# EAGLE board Inverter New 2 (EAGLE 9.1.2), part 1 of 2
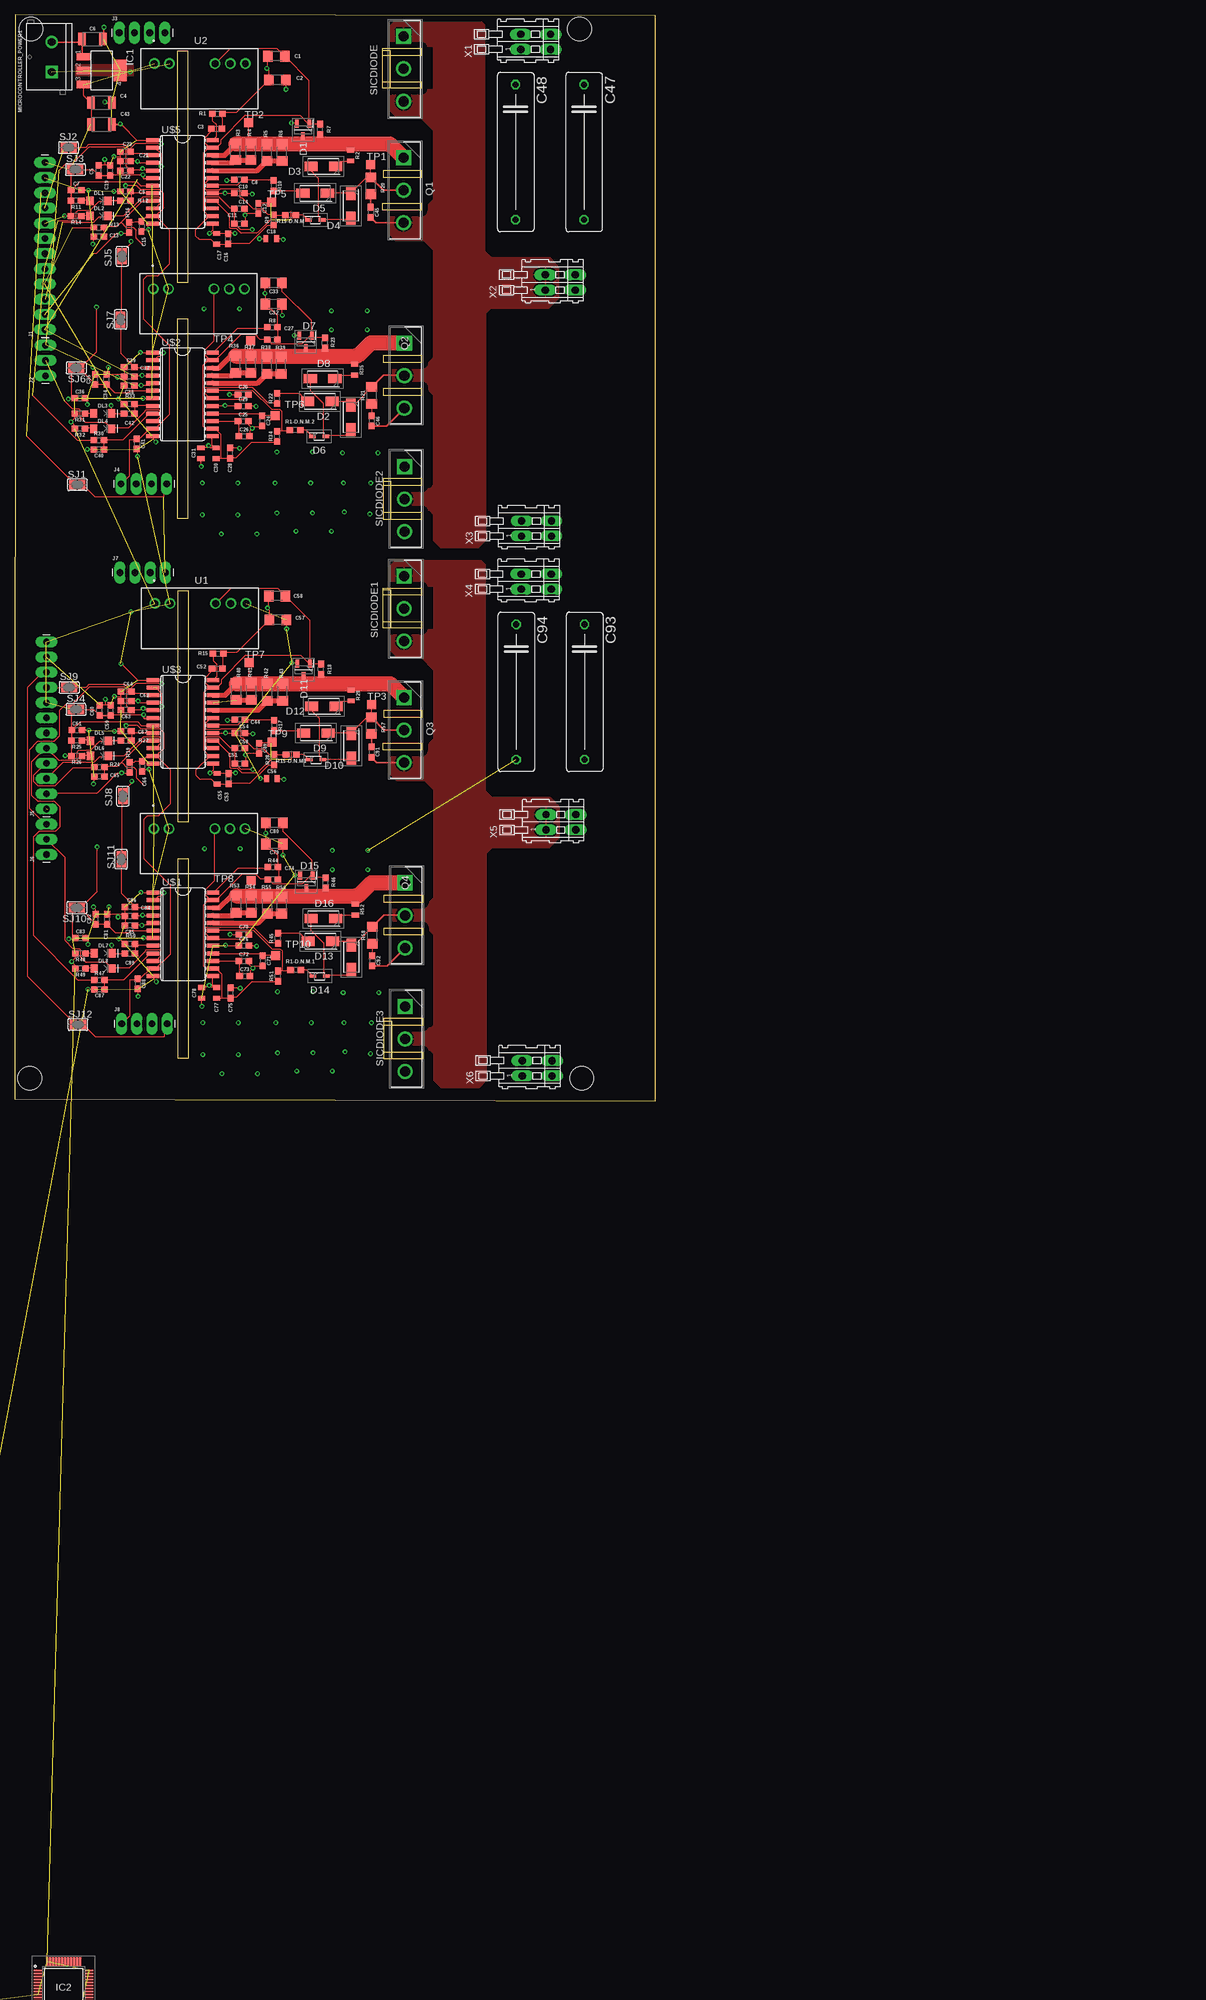
[diagram p5: board, top side]
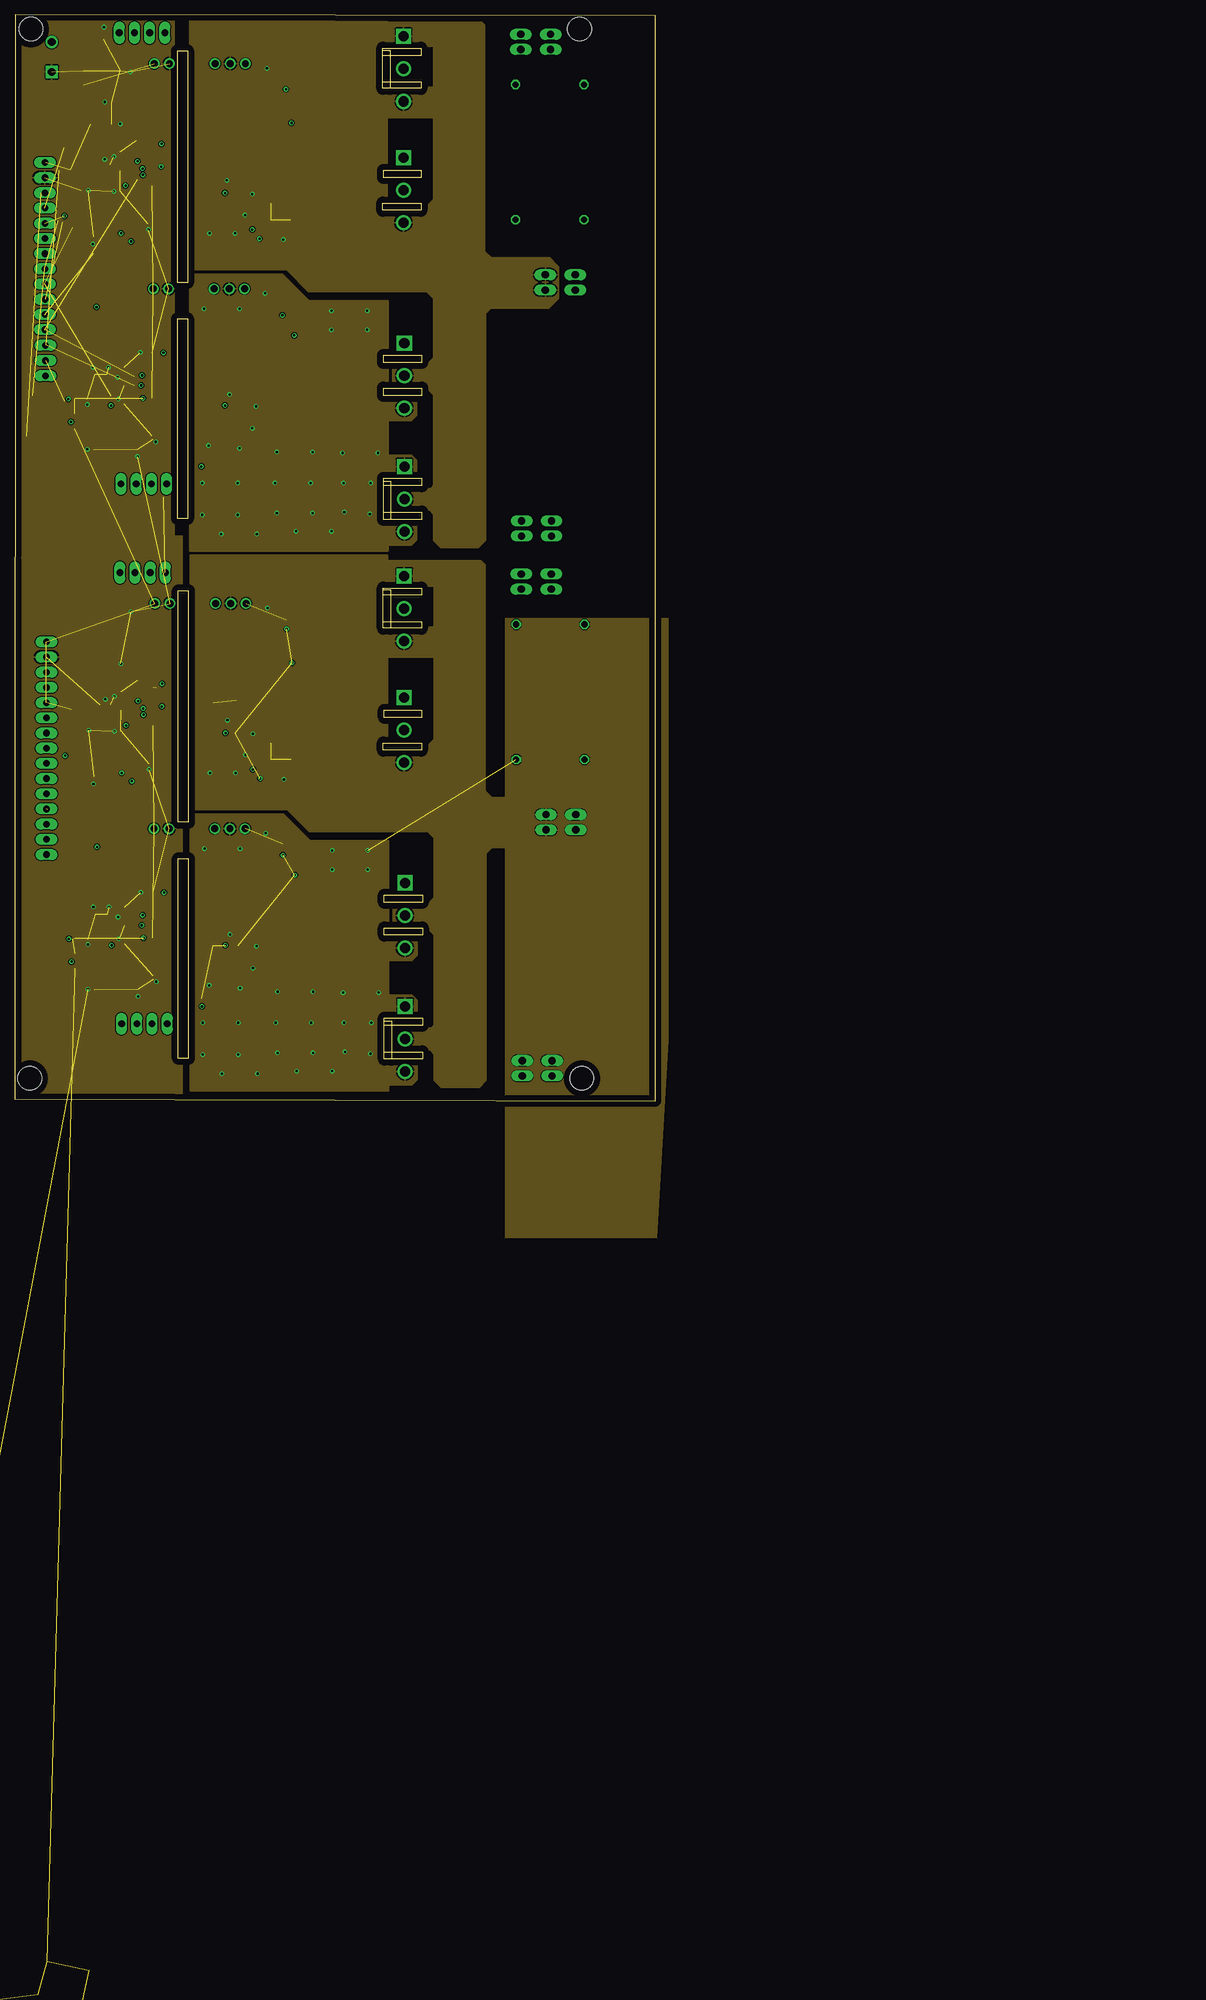
[diagram p6: board, inner layer Route2]
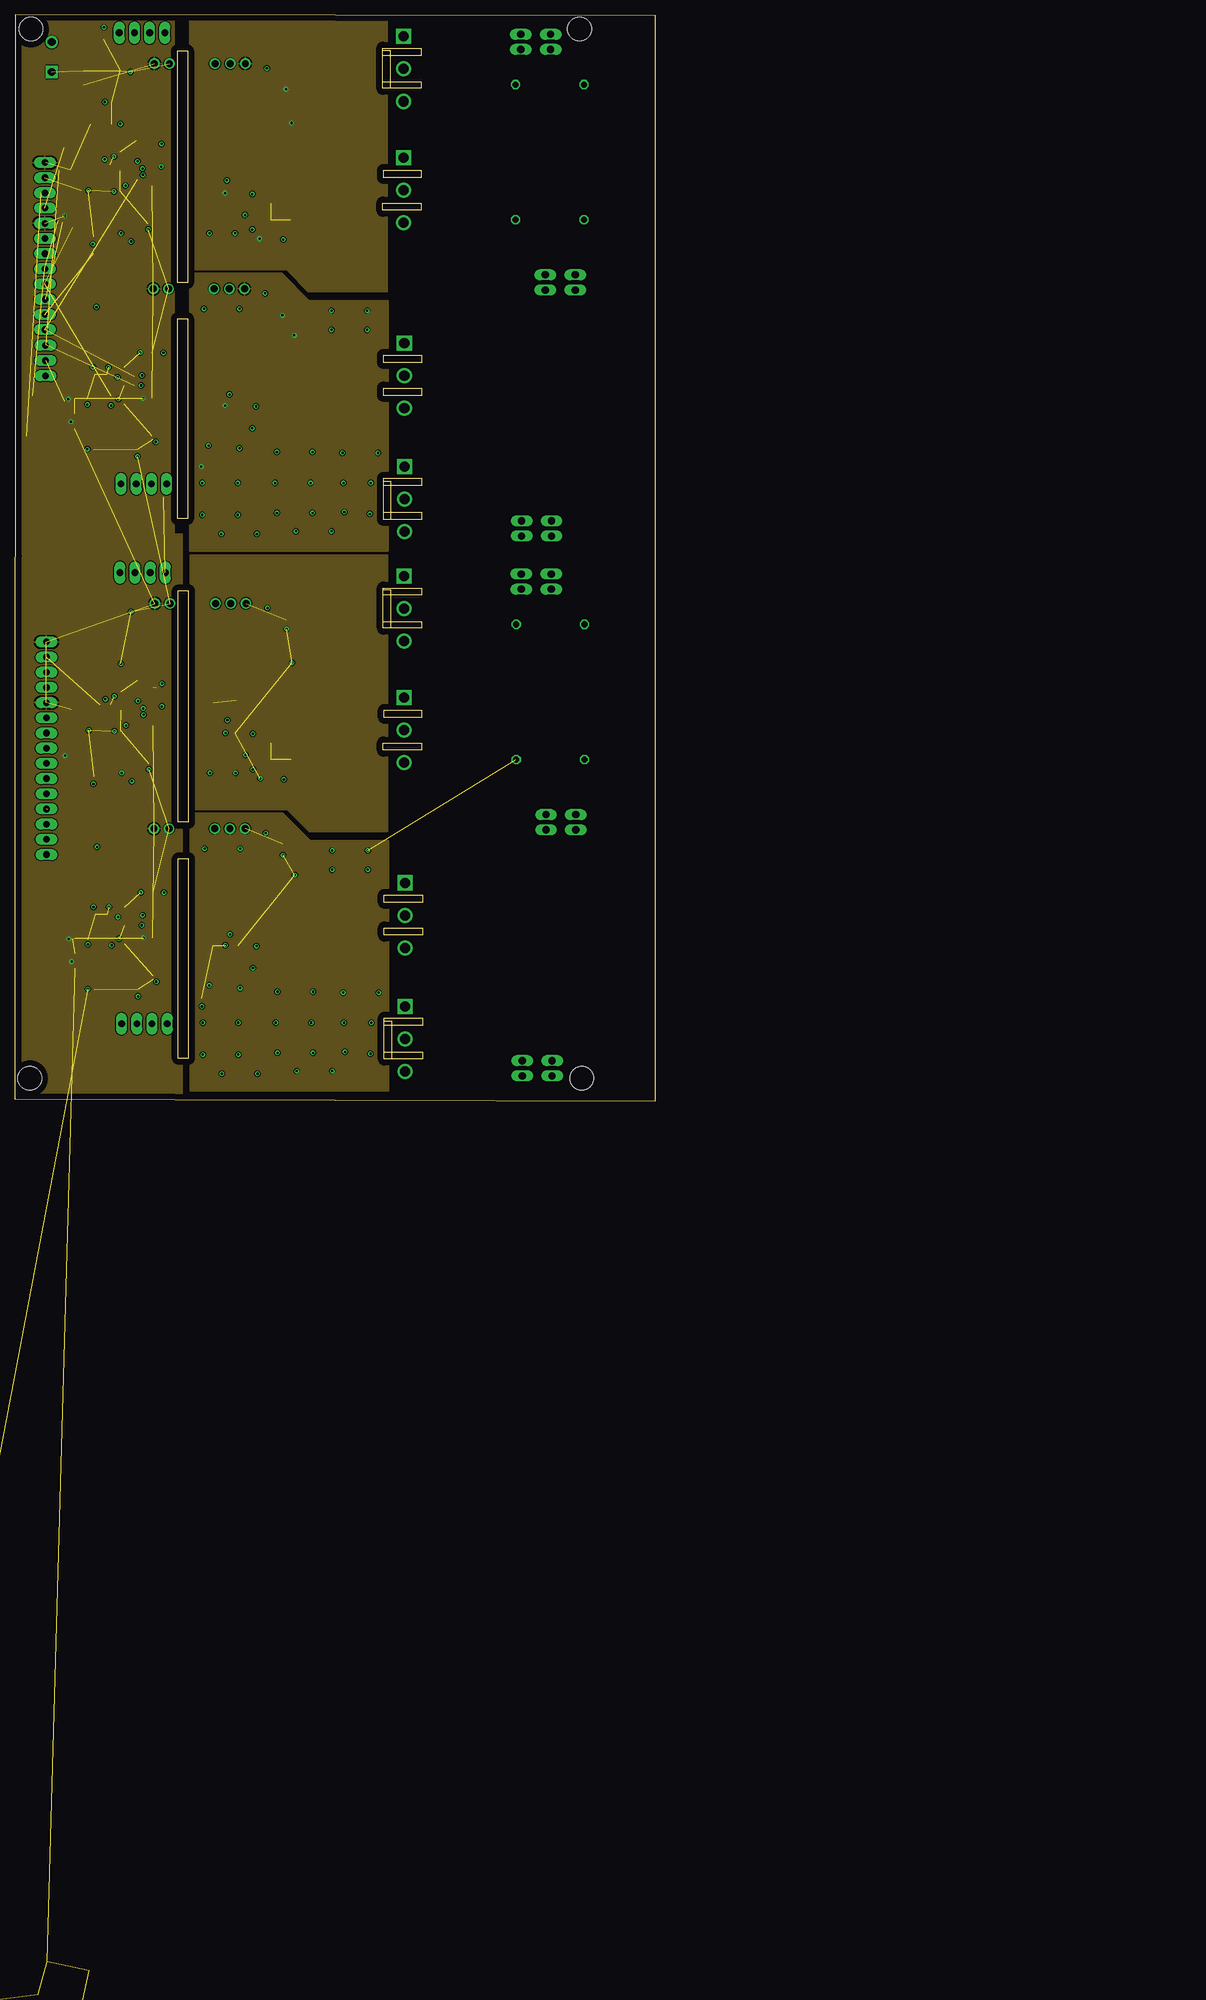
[diagram p7: board, inner layer Route15]
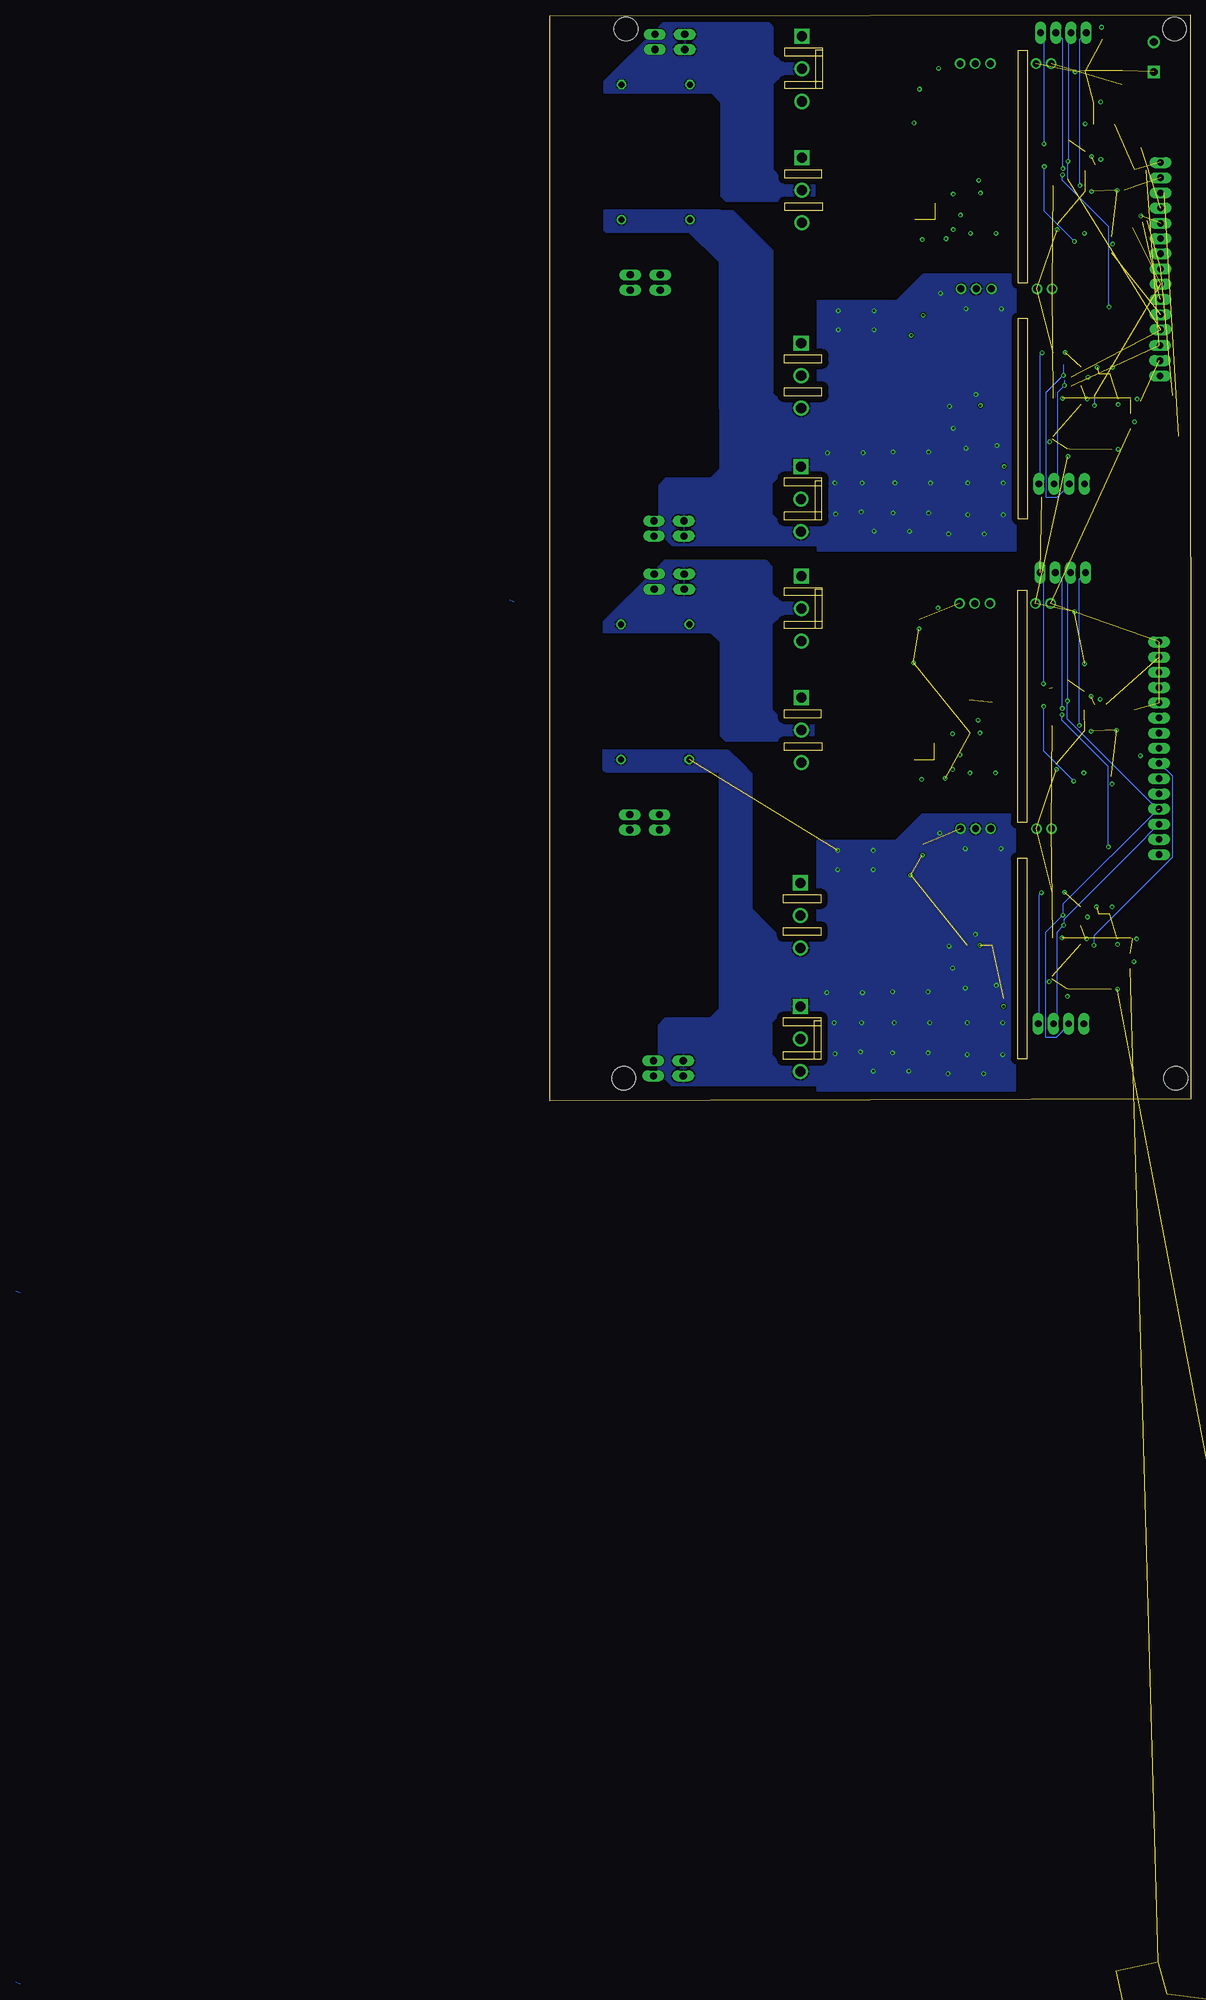
[diagram p8: board, bottom side, seen from below]

Size 107.17 x 181.59 mm. Coordinates in mm from the lower left corner, seen from the top.
Outline: 0,0.3 107.12,0 107.17,181.44 0.05,181.59 0,0.3
Copper layers (1*2+15*16): Top 0.035mm / dielectric 1.15mm / Route2 0.035mm / dielectric 0.15mm / Route15 0.035mm / dielectric 0.2mm / Bottom 0.035mm
Design rules "default *": minimum track width 6mil, minimum drill 0.35mm, track to track 6mil, track to pad 6mil, pad to pad 6mil, via to via 6mil, smd to smd 6mil, copper to edge 40mil, drill to drill 6mil, minimum pad ring 10mil, minimum via ring 8mil, stop-mask expansion 4mil, vias tented up to drill 0mil, thermal gap 10mil
Net classes: 0 default: width 0.1 mm, drill 0.2 mm, clearance 0.003 mm
Holes 4 mm at 94.41,179.23 2.67,179.23 94.81,3.77 2.46,3.77

## Footprints (pad centres in the part's own frame; a part is rotated, then mirrored left to right if it is on the bottom)
SPARKFUN-CAPACITORS_1206 = smd 1.6 x 1.8: 1 -1.4,0; 2 1.4,0
SPARKFUN-CAPACITORS_0603 = smd 1.1 x 1: 1 -0.85,0; 2 0.85,0
SPARKFUN-CAPACITORS_1210 = smd 1.27 x 2.06: 1 -1.755,0; 2 1.755,0
SPARKFUN-CAPACITORS_0805 = smd 0.8 x 1.2: 1 -0.9,0; 2 0.9,0
C225-062X268 = drill 1.016 octagon: 1 -11.303,0; 2 11.303,0
BAT54SFILM_SOT105P242X150-3N = smd 1.35 x 0.6: 1 -1.05,1.05; 2 -1.05,-1.05; 3 1.05,0
STTH112A_DIOM5126X265N = smd 2.2 x 1.55: 1 -2.05,0; 2 2.05,0
STPS2H100A_DIOM5126X265N = smd 2.2 x 1.55: 1 -2.05,0; 2 2.05,0
BAT20JFILM_SOD2512X113N = smd 1.11 x 0.55: 1 -1.14,0; 2 1.14,0
SPARKFUN-LED_LED-1206 = smd 1.2 x 1.4: A -1.5,0; C 1.5,0
NATIONAL-SEMICONDUCTOR_SOT223 = smd 1.219 x 2.235: 1 -2.311,-3.099; 2 0,-3.099; 3 2.311,-3.099 | smd 3.6 x 2.2: 4 0,3.099
QFP50P900X900X160-48N = smd 1.475 x 0.3: 1 -4.238,2.75; 2 -4.238,2.25; 3 -4.238,1.75; 4 -4.238,1.25; 5 -4.238,0.75; 6 -4.238,0.25; 7 -4.238,-0.25; 8 -4.238,-0.75; 9 -4.238,-1.25; 10 -4.238,-1.75; 11 -4.238,-2.25; 12 -4.238,-2.75; 25 4.238,-2.75; 26 4.238,-2.25; 27 4.238,-1.75; 28 4.238,-1.25; 29 4.238,-0.75; 30 4.238,-0.25; 31 4.238,0.25; 32 4.238,0.75; 33 4.238,1.25; 34 4.238,1.75; 35 4.238,2.25; 36 4.238,2.75 | smd 0.3 x 1.475: 13 -2.75,-4.238; 14 -2.25,-4.238; 15 -1.75,-4.238; 16 -1.25,-4.238; 17 -0.75,-4.238; 18 -0.25,-4.238; 19 0.25,-4.238; 20 0.75,-4.238; 21 1.25,-4.238; 22 1.75,-4.238; 23 2.25,-4.238; 24 2.75,-4.238; 37 2.75,4.238; 38 2.25,4.238; 39 1.75,4.238; 40 1.25,4.238; 41 0.75,4.238; 42 0.25,4.238; 43 -0.25,4.238; 44 -0.75,4.238; 45 -1.25,4.238; 46 -1.75,4.238; 47 -2.25,4.238; 48 -2.75,4.238
RN42IRM630 = smd 2 x 0.8: 1 -6,5.75; 2 -6,4.55; 3 -6,3.35; 4 -6,2.15; 5 -6,0.95; 6 -6,-0.25; 7 -6,-1.45; 8 -6,-2.65; 9 -6,-3.85; 10 -6,-5.05; 11 -6,-6.25; 12 -6,-7.45; 13 6.8,-7.45; 14 6.8,-6.25; 15 6.8,-5.05; 16 6.8,-3.85; 17 6.8,-2.65; 18 6.8,-1.45; 19 6.8,-0.25; 20 6.8,0.95; 21 6.8,2.15; 22 6.8,3.35; 23 6.8,4.55; 24 6.8,5.75 | smd 0.8 x 2: 28 3.8,-10.25; 29 -2.4,-10.25; 30 4.8,-10.25; 31 2.5,-10.25; 32 1.3,-10.25; 33 0.1,-10.25; 34 -1.1,-10.25; 35 -3.4,-10.25 | smd 1.8 x 1: 36 -4.9,9.45; 37 -4.9,-9.55; 38 6.3,-9.55; 39 6.3,9.45
SPARKFUN-CONNECTORS_1X12_LONGPADS = drill 1.118 pad 1.88 long: 1 0,0; 2 2.54,0; 3 5.08,0; 4 7.62,0; 5 10.16,0; 6 12.7,0; 7 15.24,0; 8 17.78,0; 9 20.32,0; 10 22.86,0; 11 25.4,0; 12 27.94,0
SPARKFUN-CONNECTORS_1X03_LONGPADS = drill 1.118 pad 1.88 long: 1 0,0; 2 2.54,0; 3 5.08,0
SPARKFUN-CONNECTORS_1X04_LONGPADS = drill 1.118 pad 1.88 long: 1 0,0; 2 2.54,0; 3 5.08,0; 4 7.62,0
SPARKFUN-CONNECTORS_SCREWTERMINAL-5MM-2 = drill 1.3 pad 2.032 square: 1 0,0 | drill 1.3 pad 2.032: 2 5,0
C2M0280120D_TO544P521X1594X2550-3P = drill 1.69 pad 2.535 square: 1 0,0 | drill 1.69 pad 2.535: 2 5.44,0; 3 10.88,0
SPARKFUN-RESISTORS_0603 = smd 1.1 x 1: 1 -0.85,0; 2 0.85,0
SPARKFUN-RESISTORS_0805 = smd 0.8 x 1.2: 1 -0.9,0; 2 0.9,0
SPARKFUN-RESISTORS_1206 = smd 1.6 x 1.8: 1 -1.4,0; 2 1.4,0
JUMPER_SJ = smd 1.168 x 1.6: 1 -0.762,0; 2 0.762,0
TP15SQ = smd 1.5 x 1.5: TP 0,0
SAMACSYS_LIB_MGJ2D_7-PIN-SIP = drill 1.15 pad 1.75: 1 2.27,-2.53; 2 4.81,-2.53; 5 12.43,-2.53; 6 14.97,-2.53; 7 17.51,-2.53
SO24E-IC_SO24W = smd 0.66 x 2.032: 1 -4.445,-3.759; 2 -3.175,-3.759; 3 -1.905,-3.759; 4 -0.635,-3.759; 5 0.635,-3.759; 6 1.905,-3.759; 7 3.175,-3.759; 8 4.445,-3.759; 9 5.715,-3.759; 10 6.985,-3.759; 11 8.255,-3.759; 12 9.525,-3.759; 13 9.525,6.299; 14 8.255,6.299; 15 6.985,6.299; 16 5.715,6.299; 17 4.445,6.299; 18 3.175,6.299; 19 1.905,6.299; 20 0.635,6.299; 21 -0.635,6.299; 22 -1.905,6.299; 23 -3.175,6.299; 24 -4.445,6.299
234-502 = drill 1.2 long: A1 -1.27,2.5; A2 1.27,2.5; B1 -1.27,-2.5; B2 1.27,-2.5

## Placement (x,y rotation side)
C1  2.2uF  [SPARKFUN-CAPACITORS_1206]  43.74,174.69 180 top
C2  2.2uF  [SPARKFUN-CAPACITORS_1206]  43.89,170.72 180 top
C3  0.1uF  [SPARKFUN-CAPACITORS_0603]  33.73,162.57 0 top
C4  10uF  [SPARKFUN-CAPACITORS_1210]  14.45,166.91 0 top
C5  0.1uF  [SPARKFUN-CAPACITORS_0603]  14.05,155.58 90 top
C6  10uF  [SPARKFUN-CAPACITORS_1210]  12.98,177.56 0 top
C7  0.1uF  [SPARKFUN-CAPACITORS_0603]  10.26,152.26 0 top
C8  100pF  [SPARKFUN-CAPACITORS_0603]  37.54,154.01 180 top
C9  100pF  [SPARKFUN-CAPACITORS_0603]  18.49,152.08 180 top
C10  0.1uF  [SPARKFUN-CAPACITORS_0603]  37.54,151.77 0 top
C11  0.1uF  [SPARKFUN-CAPACITORS_0603]  37.54,146.69 0 top
C12  1nF  [SPARKFUN-CAPACITORS_0603]  40.72,149.24 270 top
C13  100pF  [SPARKFUN-CAPACITORS_0603]  14.05,144.49 180 top
C14  4.7uF  [SPARKFUN-CAPACITORS_0603]  37.54,149.24 0 top
C15  100pF  [SPARKFUN-CAPACITORS_0603]  21.16,146.21 270 top
C16  0.1uF  [SPARKFUN-CAPACITORS_0603]  35.64,144.16 90 top
C17  1.0uF  [SPARKFUN-CAPACITORS_0805]  33.73,144.16 90 top
C18  1.0uF  [SPARKFUN-CAPACITORS_0805]  42.87,144.16 0 top
C19  4.7uF  [SPARKFUN-CAPACITORS_0603]  15.95,155.58 90 top
C20  100pF  [SPARKFUN-CAPACITORS_0603]  38.18,118.12 180 top
C21  47pF  [SPARKFUN-CAPACITORS_0603]  18.49,157.16 180 top
C22  47pF  [SPARKFUN-CAPACITORS_0603]  18.49,155.58 180 top
C23  47pF  [SPARKFUN-CAPACITORS_0603]  18.49,158.73 180 top
C24  1nF  [SPARKFUN-CAPACITORS_0603]  41.35,113.7 270 top
C25  4.7uF  [SPARKFUN-CAPACITORS_0603]  38.18,113.67 0 top
C26  0.1uF  [SPARKFUN-CAPACITORS_0603]  38.33,111.16 0 top
C27  0.1uF  [SPARKFUN-CAPACITORS_0603]  43.05,127.31 0 top
C28  0.1uF  [SPARKFUN-CAPACITORS_0603]  35.99,108.32 90 top
C29  0.1uF  [SPARKFUN-CAPACITORS_0603]  38.18,116.22 0 top
C30  1.0uF  [SPARKFUN-CAPACITORS_0805]  33.63,108.32 90 top
C31  1.0uF  [SPARKFUN-CAPACITORS_0805]  31.11,108.32 90 top
C32  2.2uF  [SPARKFUN-CAPACITORS_1206]  43.28,133.23 180 top
C33  2.2uF  [SPARKFUN-CAPACITORS_1206]  43.28,136.76 180 top
C34  4.7uF  [SPARKFUN-CAPACITORS_0603]  15.32,120.66 90 top
C35  0.1uF  [SPARKFUN-CAPACITORS_0603]  13.41,120.66 90 top
C36  0.1uF  [SPARKFUN-CAPACITORS_0603]  10.87,117.48 0 top
C37  47pF  [SPARKFUN-CAPACITORS_0603]  19.13,121.14 180 top
C38  47pF  [SPARKFUN-CAPACITORS_0603]  19.13,119.57 180 top
C39  47pF  [SPARKFUN-CAPACITORS_0603]  19.13,122.72 180 top
C40  100pF  [SPARKFUN-CAPACITORS_0603]  14.05,108.93 180 top
C41  100pF  [SPARKFUN-CAPACITORS_0603]  20.4,109.86 270 top
C42  100pF  [SPARKFUN-CAPACITORS_0603]  19.13,116.52 180 top
C43  10uF  [SPARKFUN-CAPACITORS_1210]  14.45,163.28 0 top
C44  100pF  [SPARKFUN-CAPACITORS_0603]  37.64,63.74 180 top
C45  100pF  [SPARKFUN-CAPACITORS_0603]  59.51,148.6 270 top
C46  100pF  [SPARKFUN-CAPACITORS_0603]  59.66,113.7 270 top
C47  [C225-062X268]  95.17,158.66 270 top
C48  [C225-062X268]  83.74,158.66 270 top
C49  1nF  [SPARKFUN-CAPACITORS_0603]  40.81,58.97 270 top
C50  4.7uF  [SPARKFUN-CAPACITORS_0603]  37.64,58.97 0 top
C51  0.1uF  [SPARKFUN-CAPACITORS_0603]  37.64,56.43 0 top
C52  0.1uF  [SPARKFUN-CAPACITORS_0603]  33.83,72.3 0 top
C53  0.1uF  [SPARKFUN-CAPACITORS_0603]  35.73,53.89 90 top
C54  0.1uF  [SPARKFUN-CAPACITORS_0603]  37.64,61.51 0 top
C55  1.0uF  [SPARKFUN-CAPACITORS_0805]  33.83,53.89 90 top
C56  1.0uF  [SPARKFUN-CAPACITORS_0805]  42.97,53.89 0 top
C57  2.2uF  [SPARKFUN-CAPACITORS_1206]  43.99,80.46 180 top
C58  2.2uF  [SPARKFUN-CAPACITORS_1206]  43.84,84.42 180 top
C59  4.7uF  [SPARKFUN-CAPACITORS_0603]  16.05,65.32 90 top
C60  0.1uF  [SPARKFUN-CAPACITORS_0603]  14.14,65.32 90 top
C61  0.1uF  [SPARKFUN-CAPACITORS_0603]  10.36,61.99 0 top
C62  47pF  [SPARKFUN-CAPACITORS_0603]  18.59,66.89 180 top
C63  47pF  [SPARKFUN-CAPACITORS_0603]  18.59,65.32 180 top
C64  47pF  [SPARKFUN-CAPACITORS_0603]  18.59,68.47 180 top
C65  100pF  [SPARKFUN-CAPACITORS_0603]  14.14,54.22 180 top
C66  100pF  [SPARKFUN-CAPACITORS_0603]  21.26,55.94 270 top
C67  100pF  [SPARKFUN-CAPACITORS_0603]  18.59,61.81 180 top
C70  100pF  [SPARKFUN-CAPACITORS_0603]  38.27,27.85 180 top
C71  1nF  [SPARKFUN-CAPACITORS_0603]  41.45,23.43 270 top
C72  4.7uF  [SPARKFUN-CAPACITORS_0603]  38.27,23.41 0 top
C73  0.1uF  [SPARKFUN-CAPACITORS_0603]  38.43,20.89 0 top
C74  0.1uF  [SPARKFUN-CAPACITORS_0603]  43.15,37.05 0 top
C75  0.1uF  [SPARKFUN-CAPACITORS_0603]  36.09,18.05 90 top
C76  0.1uF  [SPARKFUN-CAPACITORS_0603]  38.27,25.95 0 top
C77  1.0uF  [SPARKFUN-CAPACITORS_0805]  33.73,18.05 90 top
C78  1.0uF  [SPARKFUN-CAPACITORS_0805]  31.21,18.05 90 top
C79  2.2uF  [SPARKFUN-CAPACITORS_1206]  43.38,42.97 180 top
C80  2.2uF  [SPARKFUN-CAPACITORS_1206]  43.38,46.5 180 top
C81  4.7uF  [SPARKFUN-CAPACITORS_0603]  15.41,30.39 90 top
C82  0.1uF  [SPARKFUN-CAPACITORS_0603]  13.51,30.39 90 top
C83  0.1uF  [SPARKFUN-CAPACITORS_0603]  10.97,27.22 0 top
C84  47pF  [SPARKFUN-CAPACITORS_0603]  19.22,30.87 180 top
C85  47pF  [SPARKFUN-CAPACITORS_0603]  19.22,29.3 180 top
C86  47pF  [SPARKFUN-CAPACITORS_0603]  19.22,32.45 180 top
C87  100pF  [SPARKFUN-CAPACITORS_0603]  14.14,18.66 180 top
C88  100pF  [SPARKFUN-CAPACITORS_0603]  20.49,19.6 270 top
C89  100pF  [SPARKFUN-CAPACITORS_0603]  19.22,26.25 180 top
C91  100pF  [SPARKFUN-CAPACITORS_0603]  59.61,58.33 270 top
C92  100pF  [SPARKFUN-CAPACITORS_0603]  59.76,23.43 270 top
C93  [C225-062X268]  95.27,68.39 270 top
C94  [C225-062X268]  83.84,68.39 270 top
D1  BAT54SFILM_BAT54SFILM  [BAT54SFILM_SOT105P242X150-3N]  48.18,162.34 270 top
D2  STTH112A_STTH112A  [STTH112A_DIOM5126X265N]  50.98,116.95 180 top
D3  STPS2H100A_STPS2H100A  [STPS2H100A_DIOM5126X265N]  51.56,156.25 180 top
D4  BAT20JFILM_BAT20JFILM  [BAT20JFILM_SOD2512X113N]  50.24,147.33 0 top
D5  STTH112A_STTH112A  [STTH112A_DIOM5126X265N]  50.21,151.77 180 top
D6  BAT20JFILM_BAT20JFILM  [BAT20JFILM_SOD2512X113N]  50.88,111.13 0 top
D7  BAT54SFILM_BAT54SFILM  [BAT54SFILM_SOT105P242X150-3N]  48.64,126.91 270 top
D8  STPS2H100A_STPS2H100A  [STPS2H100A_DIOM5126X265N]  51.46,120.76 180 top
D9  STTH112A_STTH112A  [STTH112A_DIOM5126X265N]  50.31,61.51 180 top
D9-D.N.M  STPS2H100A_STPS2H100A  [STPS2H100A_DIOM5126X265N]  56.16,149.67 270 top
D9-D.N.M1  STPS2H100A_STPS2H100A  [STPS2H100A_DIOM5126X265N]  56.26,59.4 270 top
D9-D.N.M.1  STPS2H100A_STPS2H100A  [STPS2H100A_DIOM5126X265N]  56.26,24.04 270 top
D9-D.N.M.2  STPS2H100A_STPS2H100A  [STPS2H100A_DIOM5126X265N]  56.16,114.31 270 top
D10  BAT20JFILM_BAT20JFILM  [BAT20JFILM_SOD2512X113N]  50.34,57.06 0 top
D11  BAT54SFILM_BAT54SFILM  [BAT54SFILM_SOT105P242X150-3N]  48.28,72.07 270 top
D12  STPS2H100A_STPS2H100A  [STPS2H100A_DIOM5126X265N]  51.66,65.98 180 top
D13  STTH112A_STTH112A  [STTH112A_DIOM5126X265N]  51.08,26.68 180 top
D14  BAT20JFILM_BAT20JFILM  [BAT20JFILM_SOD2512X113N]  50.97,20.87 0 top
D15  BAT54SFILM_BAT54SFILM  [BAT54SFILM_SOT105P242X150-3N]  48.74,36.64 270 top
D16  STPS2H100A_STPS2H100A  [STPS2H100A_DIOM5126X265N]  51.56,30.49 180 top
DL1  RED  [SPARKFUN-LED_LED-1206]  14.05,150.5 0 top
DL2  RED  [SPARKFUN-LED_LED-1206]  14.05,147.96 0 top
DL3  RED  [SPARKFUN-LED_LED-1206]  14.68,114.94 0 top
DL4  RED  [SPARKFUN-LED_LED-1206]  14.68,112.41 0 top
DL5  RED  [SPARKFUN-LED_LED-1206]  14.14,60.24 0 top
DL6  RED  [SPARKFUN-LED_LED-1206]  14.14,57.7 0 top
DL7  RED  [SPARKFUN-LED_LED-1206]  14.78,24.68 0 top
DL8  RED  [SPARKFUN-LED_LED-1206]  14.78,22.14 0 top
IC1  NATIONAL-SEMICONDUCTOR_LM2936MP-3.0  [NATIONAL-SEMICONDUCTOR_SOT223]  14.53,172.3 270 top
IC2  STM32F103C8T6  [QFP50P900X900X160-48N]  8.16,-148.18 0 top  (outside the outline)
IC3  RN42-I_RM630  [RN42IRM630]  -11.94,-145.93 0 top  (outside the outline)
J1  [SPARKFUN-CONNECTORS_1X12_LONGPADS]  5.01,128.97 90 top
J2  [SPARKFUN-CONNECTORS_1X03_LONGPADS]  5.11,121.25 90 top
J3  [SPARKFUN-CONNECTORS_1X04_LONGPADS]  17.45,178.62 0 top
J4  [SPARKFUN-CONNECTORS_1X04_LONGPADS]  17.75,103.18 0 top
J5  [SPARKFUN-CONNECTORS_1X12_LONGPADS]  5.25,48.81 90 top
J6  [SPARKFUN-CONNECTORS_1X03_LONGPADS]  5.25,41.19 90 top
J7  [SPARKFUN-CONNECTORS_1X04_LONGPADS]  17.55,88.36 0 top
J8  [SPARKFUN-CONNECTORS_1X04_LONGPADS]  17.85,12.92 0 top
MICROCONTROLLER_POWER1  [SPARKFUN-CONNECTORS_SCREWTERMINAL-5MM-2]  6.17,172.07 90 top
Q1  C2M0280120D_C2M0280120D  [C2M0280120D_TO544P521X1594X2550-3P]  64.97,157.72 270 top
Q2  C2M0280120D_C2M0280120D  [C2M0280120D_TO544P521X1594X2550-3P]  65.12,126.73 270 top
Q3  C2M0280120D_C2M0280120D  [C2M0280120D_TO544P521X1594X2550-3P]  65.07,67.45 270 top
Q4  C2M0280120D_C2M0280120D  [C2M0280120D_TO544P521X1594X2550-3P]  65.22,36.46 270 top
R1  1k  [SPARKFUN-RESISTORS_0603]  33.88,165.08 0 top
R1-D.N.M.1  0  [SPARKFUN-RESISTORS_0603]  46.96,21.91 180 top
R1-D.N.M.2  0  [SPARKFUN-RESISTORS_0603]  46.86,112.18 180 top
R2  [SPARKFUN-RESISTORS_0805]  56.13,158.07 270 top
R3  [SPARKFUN-RESISTORS_1206]  36.91,158.73 90 top
R4  [SPARKFUN-RESISTORS_1206]  39.45,158.73 90 top
R5  [SPARKFUN-RESISTORS_1206]  42.14,158.58 90 top
R6  [SPARKFUN-RESISTORS_1206]  44.68,158.58 90 top
R7  47k  [SPARKFUN-RESISTORS_0603]  51.08,162.47 90 top
R8  1k  [SPARKFUN-RESISTORS_0603]  43.05,129.37 0 top
R9  0  [SPARKFUN-RESISTORS_0603]  43.26,147.33 90 top
R10  1k  [SPARKFUN-RESISTORS_0603]  43.26,153.05 270 top
R11  [SPARKFUN-RESISTORS_0603]  10.24,150.5 180 top
R12  100  [SPARKFUN-RESISTORS_0603]  18.49,150.5 0 top
R13  100  [SPARKFUN-RESISTORS_0603]  14.05,146.06 0 top
R14  [SPARKFUN-RESISTORS_0603]  10.24,147.96 180 top
R15  1k  [SPARKFUN-RESISTORS_0603]  33.98,74.82 0 top
R15-D.N.M  0  [SPARKFUN-RESISTORS_0603]  46.1,148.14 180 top
R15-D.N.M1  0  [SPARKFUN-RESISTORS_0603]  46.2,57.88 180 top
R16  100  [SPARKFUN-RESISTORS_0603]  19.13,146.06 90 top
R17  1k  [SPARKFUN-RESISTORS_0603]  43.35,62.78 270 top
R18  47k  [SPARKFUN-RESISTORS_0603]  51.18,72.2 90 top
R19  100  [SPARKFUN-RESISTORS_0603]  19.22,55.79 90 top
R20  [SPARKFUN-RESISTORS_1206]  59.51,153.02 90 top
R21  [SPARKFUN-RESISTORS_1206]  59.66,117.97 90 top
R22  1k  [SPARKFUN-RESISTORS_0603]  43.89,117.46 90 top
R23  47k  [SPARKFUN-RESISTORS_0603]  51.84,126.73 90 top
R24  100  [SPARKFUN-RESISTORS_0603]  14.14,55.79 0 top
R25  [SPARKFUN-RESISTORS_0603]  10.33,60.24 180 top
R26  [SPARKFUN-RESISTORS_0603]  10.33,57.7 180 top
R27  100  [SPARKFUN-RESISTORS_0603]  18.59,60.24 0 top
R28  0  [SPARKFUN-RESISTORS_0603]  43.35,57.06 90 top
R29  [SPARKFUN-RESISTORS_0805]  56.23,67.81 270 top
R30  100  [SPARKFUN-RESISTORS_0603]  14.05,110.5 0 top
R31  [SPARKFUN-RESISTORS_0603]  10.87,114.94 180 top
R32  [SPARKFUN-RESISTORS_0603]  10.87,112.41 180 top
R33  100  [SPARKFUN-RESISTORS_0603]  19.13,114.94 0 top
R34  0  [SPARKFUN-RESISTORS_0603]  43.89,111.13 90 top
R35  [SPARKFUN-RESISTORS_0805]  56.82,122.26 270 top
R36  [SPARKFUN-RESISTORS_1206]  36.91,123.15 90 top
R37  [SPARKFUN-RESISTORS_1206]  39.45,123.15 90 top
R38  [SPARKFUN-RESISTORS_1206]  42.14,123 90 top
R39  [SPARKFUN-RESISTORS_1206]  44.53,123 90 top
R40  [SPARKFUN-RESISTORS_1206]  37,68.47 90 top
R41  [SPARKFUN-RESISTORS_1206]  39.54,68.47 90 top
R42  [SPARKFUN-RESISTORS_1206]  42.24,68.31 90 top
R43  [SPARKFUN-RESISTORS_1206]  44.78,68.31 90 top
R44  1k  [SPARKFUN-RESISTORS_0603]  43.15,39.1 0 top
R45  1k  [SPARKFUN-RESISTORS_0603]  43.99,27.19 90 top
R46  47k  [SPARKFUN-RESISTORS_0603]  51.94,36.46 90 top
R47  100  [SPARKFUN-RESISTORS_0603]  14.14,20.23 0 top
R48  [SPARKFUN-RESISTORS_0603]  10.97,24.68 180 top
R49  [SPARKFUN-RESISTORS_0603]  10.97,22.14 180 top
R50  100  [SPARKFUN-RESISTORS_0603]  19.22,24.68 0 top
R51  0  [SPARKFUN-RESISTORS_0603]  43.99,20.87 90 top
R52  [SPARKFUN-RESISTORS_0805]  56.92,31.99 270 top
R53  [SPARKFUN-RESISTORS_1206]  37,32.88 90 top
R54  [SPARKFUN-RESISTORS_1206]  39.54,32.88 90 top
R55  [SPARKFUN-RESISTORS_1206]  42.24,32.73 90 top
R56  [SPARKFUN-RESISTORS_1206]  44.62,32.73 90 top
R57  [SPARKFUN-RESISTORS_1206]  59.61,62.75 90 top
R58  [SPARKFUN-RESISTORS_1206]  59.76,27.7 90 top
SICDIODE  C2M0280120D_C2M0280120D  [C2M0280120D_TO544P521X1594X2550-3P]  65,178.01 270 top
SICDIODE1  C2M0280120D_C2M0280120D  [C2M0280120D_TO544P521X1594X2550-3P]  65.1,87.75 270 top
SICDIODE2  C2M0280120D_C2M0280120D  [C2M0280120D_TO544P521X1594X2550-3P]  65.15,106.08 270 top
SICDIODE3  C2M0280120D_C2M0280120D  [C2M0280120D_TO544P521X1594X2550-3P]  65.25,15.81 270 top
SJ1  [JUMPER_SJ]  10.44,103.03 0 top
SJ2  [JUMPER_SJ]  8.97,159.39 180 top
SJ3  [JUMPER_SJ]  10.11,155.74 180 top
SJ4  [JUMPER_SJ]  10.21,65.47 180 top
SJ5  [JUMPER_SJ]  17.93,141.23 270 top
SJ6  [JUMPER_SJ]  10.24,122.56 180 top
SJ7  [JUMPER_SJ]  17.68,130.67 90 top
SJ8  [JUMPER_SJ]  18.03,50.97 270 top
SJ9  [JUMPER_SJ]  9.06,69.13 180 top
SJ10  [JUMPER_SJ]  10.33,32.3 180 top
SJ11  [JUMPER_SJ]  17.78,40.4 90 top
SJ12  [JUMPER_SJ]  10.54,12.76 0 top
TP1  TPTP15SQ  [TP15SQ]  59.51,156.52 0 top
TP2  TPTP15SQ  [TP15SQ]  39.09,163.54 0 top
TP3  TPTP15SQ  [TP15SQ]  59.61,66.26 0 top
TP4  TPTP15SQ  [TP15SQ]  39.39,127.11 0 top
TP5  TPTP15SQ  [TP15SQ]  42.9,150.28 0 top
TP6  TPTP15SQ  [TP15SQ]  43.51,114.61 0 top
TP7  TPTP15SQ  [TP15SQ]  39.19,73.27 0 top
TP8  TPTP15SQ  [TP15SQ]  39.49,36.84 0 top
TP9  TPTP15SQ  [TP15SQ]  43,60.01 0 top
TP10  TPTP15SQ  [TP15SQ]  43.61,24.35 0 top
U1  SAMACSYS_LIB_MGJ2D052005SC  [SAMACSYS_LIB_MGJ2D_7-PIN-SIP]  21.13,85.71 0 top
U2  SAMACSYS_LIB_MGJ2D052005SC  [SAMACSYS_LIB_MGJ2D_7-PIN-SIP]  21.03,175.98 0 top
U3  SAMACSYS_LIB_MGJ2D052005SC  [SAMACSYS_LIB_MGJ2D_7-PIN-SIP]  20.88,138.34 0 top
U4  SAMACSYS_LIB_MGJ2D052005SC  [SAMACSYS_LIB_MGJ2D_7-PIN-SIP]  20.98,48.07 0 top
U$1  SO24E-IC_STGAP1AS  [SO24E-IC_SO24W]  26.84,30.39 270 top
U$2  SO24E-IC_STGAP1AS  [SO24E-IC_SO24W]  26.75,120.66 270 top
U$3  SO24E-IC_STGAP1AS  [SO24E-IC_SO24W]  26.84,65.95 270 top
U$5  SO24E-IC_STGAP1AS  [SO24E-IC_SO24W]  26.75,156.22 270 top
X1  [234-502]  87.1,177.1 90 top
X2  [234-502]  91.21,136.87 90 top
X3  [234-502]  87.25,95.72 90 top
X4  [234-502]  87.2,86.83 90 top
X5  [234-502]  91.31,46.6 90 top
X6  [234-502]  87.35,5.45 90 top